# Altium schematic sheet PWR_SWITCH_CON_V1.0.SchDoc
size A4
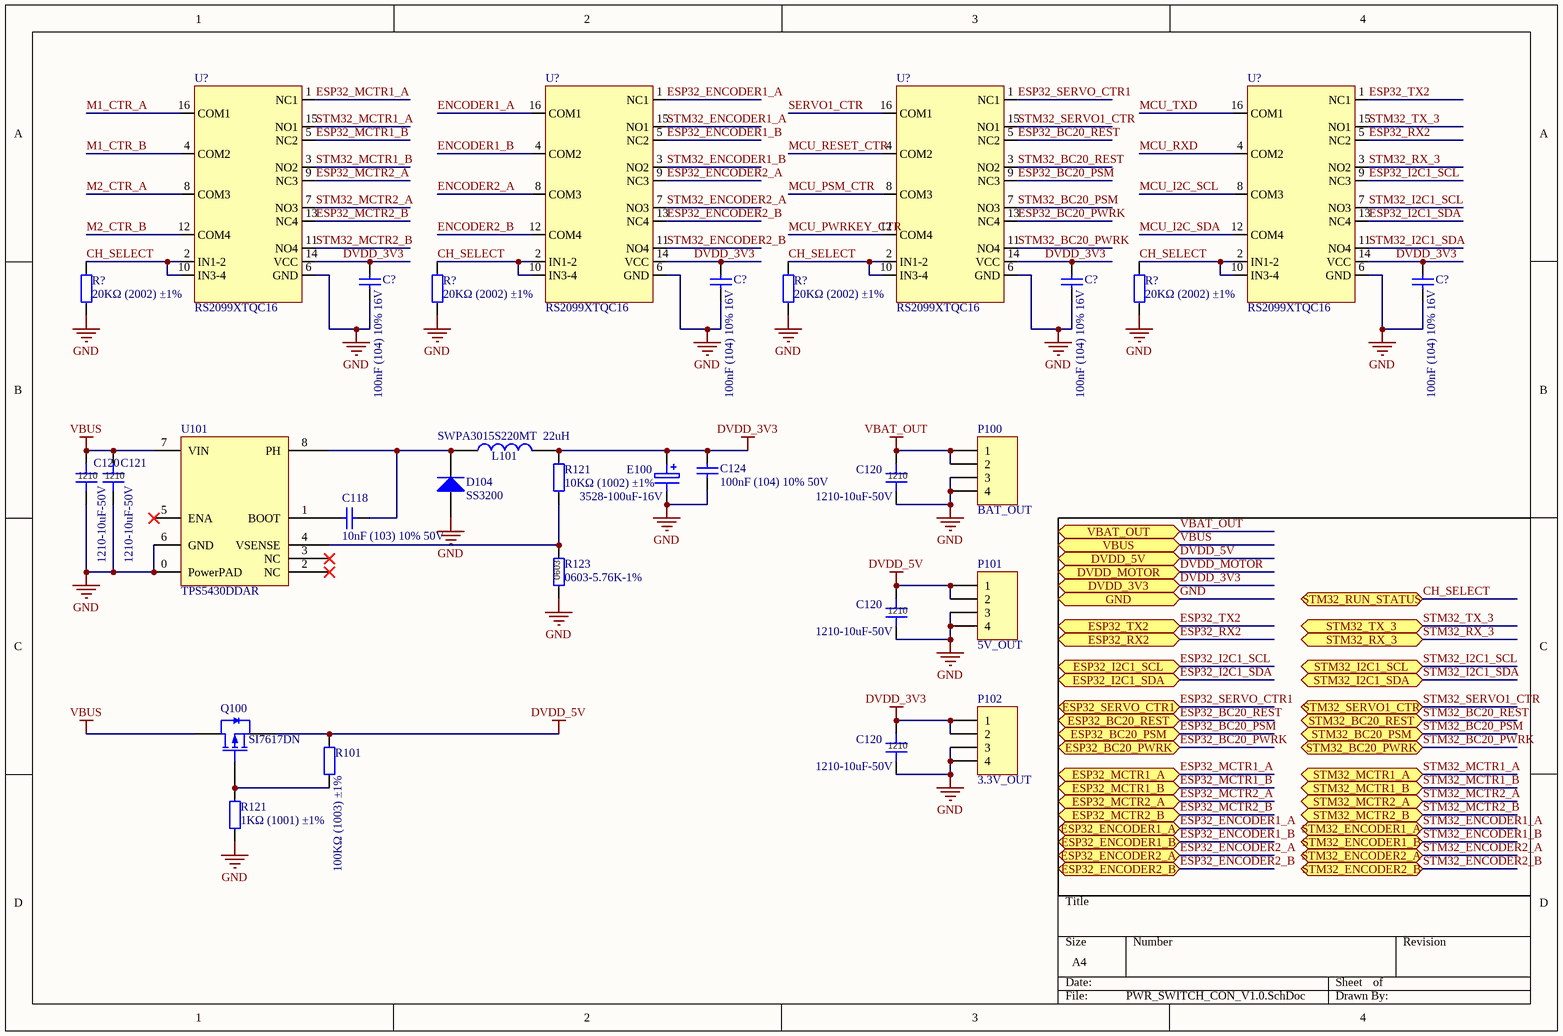
[diagram p0: PWR_SWITCH_CON_V1.0.SchDoc]

## Parts
(Parts that share a designator on the sheet are numbered #1, #2 ... from top to bottom, then left to right.)
C118  10nF (103) 10% 50V  [0603_C]
C120#1  1210-10uF-50V  [1210_C]
C120#2  1210-10uF-50V  [1210_C]
C120#3  1210-10uF-50V  [1210_C]
C120#4  1210-10uF-50V  [1210_C]
C121  1210-10uF-50V  [1210_C]
C124  100nF (104) 10% 50V  [0603_C]
C?#1  100nF (104) 10% 16V  [0402_C]
C?#2  100nF (104) 10% 16V  [0402_C]
C?#3  100nF (104) 10% 16V  [0402_C]
C?#4  100nF (104) 10% 16V  [0402_C]
D104  SS3200  [SMA(DO-214AC)_S1]
E100  3528-100uF-16V  [ES_3528]
L101  SWPA3015S220MT  22uH  [L 3.0*3.0*1.5]
P100  BAT_OUT  [HDR1X4]
P101  5V_OUT  [HDR1X4]
P102  3.3V_OUT  [HDR1X4]
Q100  SI7617DN  [PAK-1212-8]
R101  100KΩ (1003) ±1%  [0603_R]
R121#1  10KΩ (1002) ±1%  [0603_R]
R121#2  1KΩ (1001) ±1%  [0603_R]
R123  0603-5.76K-1%  [0603_R]
R?#1  20KΩ (2002) ±1%  [0402_R]
R?#2  20KΩ (2002) ±1%  [0402_R]
R?#3  20KΩ (2002) ±1%  [0402_R]
R?#4  20KΩ (2002) ±1%  [0402_R]
U101  TPS5430DDAR  [SOP-8_150mil DCDC]
U?#1  RS2099XTQC16  [QFN-16_3x3x05P]
U?#2  RS2099XTQC16  [QFN-16_3x3x05P]
U?#3  RS2099XTQC16  [QFN-16_3x3x05P]
U?#4  RS2099XTQC16  [QFN-16_3x3x05P]

## Ports
DVDD_3V3, DVDD_5V, DVDD_MOTOR, ESP32_BC20_PSM, ESP32_BC20_PWRK, ESP32_BC20_REST, ESP32_ENCODER1_A, ESP32_ENCODER1_B, ESP32_ENCODER2_A, ESP32_ENCODER2_B, ESP32_I2C1_SCL, ESP32_I2C1_SDA, ESP32_MCTR1_A, ESP32_MCTR1_B, ESP32_MCTR2_A, ESP32_MCTR2_B, ESP32_RX2, ESP32_SERVO_CTR1, ESP32_TX2, GND, STM32_BC20_PSM, STM32_BC20_PWRK, STM32_BC20_REST, STM32_ENCODER1_A, STM32_ENCODER1_B, STM32_ENCODER2_A, STM32_ENCODER2_B, STM32_I2C1_SCL, STM32_I2C1_SDA, STM32_MCTR1_A, STM32_MCTR1_B, STM32_MCTR2_A, STM32_MCTR2_B, STM32_RUN_STATUS, STM32_RX_3, STM32_SERVO1_CTR, STM32_TX_3, VBAT_OUT, VBUS

## Nets
DVDD_3V3: C120#4.1 C124.2 C?#1.2 C?#2.2 C?#3.2 C?#4.2 E100.1 L101.2 P102.1 P102.2 R121#1.2 U?#1.14(VCC) U?#2.14(VCC) U?#3.14(VCC) U?#4.14(VCC) ; port DVDD_3V3
DVDD_5V: C120#3.1 P101.1 P101.2 Q100.2(S) R101.2 ; port DVDD_5V
GND: C120#1.2 C120#2.2 C120#3.2 C120#4.2 C121.2 C124.1 C?#1.1 C?#2.1 C?#3.1 C?#4.1 D104.1(A) E100.2(E) P100.3 P100.4 P101.3 P101.4 P102.3 P102.4 R121#2.1 R123.1 R?#1.1 R?#2.1 R?#3.1 R?#4.1 U101.0(PowerPAD) U101.6(GND) U?#1.6(GND) U?#2.6(GND) U?#3.6(GND) U?#4.6(GND) ; port GND
VBAT_OUT: C120#2.1 P100.1 P100.2 ; port VBAT_OUT
VBUS: C120#1.1 C121.1 Q100.3(D) U101.7(VIN) ; port VBUS
CH_SELECT: R?#1.2 R?#2.2 R?#3.2 R?#4.2 U?#1.2(IN1-2) U?#1.10(IN3-4) U?#2.2(IN1-2) U?#2.10(IN3-4) U?#3.2(IN1-2) U?#3.10(IN3-4) U?#4.2(IN1-2) U?#4.10(IN3-4) ; port STM32_RUN_STATUS
DVDD_MOTOR: port DVDD_MOTOR
ENCODER1_A: U?#2.16(COM1)
ENCODER1_B: U?#2.4(COM2)
ENCODER2_A: U?#2.8(COM3)
ENCODER2_B: U?#2.12(COM4)
ESP32_BC20_PSM: U?#3.9(NC3) ; port ESP32_BC20_PSM
ESP32_BC20_PWRK: U?#3.13(NC4) ; port ESP32_BC20_PWRK
ESP32_BC20_REST: U?#3.5(NC2) ; port ESP32_BC20_REST
ESP32_ENCODER1_A: U?#2.1(NC1) ; port ESP32_ENCODER1_A
ESP32_ENCODER1_B: U?#2.5(NC2) ; port ESP32_ENCODER1_B
ESP32_ENCODER2_A: U?#2.9(NC3) ; port ESP32_ENCODER2_A
ESP32_ENCODER2_B: U?#2.13(NC4) ; port ESP32_ENCODER2_B
ESP32_I2C1_SCL: U?#4.9(NC3) ; port ESP32_I2C1_SCL
ESP32_I2C1_SDA: U?#4.13(NC4) ; port ESP32_I2C1_SDA
ESP32_MCTR1_A: U?#1.1(NC1) ; port ESP32_MCTR1_A
ESP32_MCTR1_B: U?#1.5(NC2) ; port ESP32_MCTR1_B
ESP32_MCTR2_A: U?#1.9(NC3) ; port ESP32_MCTR2_A
ESP32_MCTR2_B: U?#1.13(NC4) ; port ESP32_MCTR2_B
ESP32_RX2: U?#4.5(NC2) ; port ESP32_RX2
ESP32_SERVO_CTR1: U?#3.1(NC1) ; port ESP32_SERVO_CTR1
ESP32_TX2: U?#4.1(NC1) ; port ESP32_TX2
M1_CTR_A: U?#1.16(COM1)
M1_CTR_B: U?#1.4(COM2)
M2_CTR_A: U?#1.8(COM3)
M2_CTR_B: U?#1.12(COM4)
MCU_I2C_SCL: U?#4.8(COM3)
MCU_I2C_SDA: U?#4.12(COM4)
MCU_PSM_CTR: U?#3.8(COM3)
MCU_PWRKEY_CTR: U?#3.12(COM4)
MCU_RESET_CTR: U?#3.4(COM2)
MCU_RXD: U?#4.4(COM2)
MCU_TXD: U?#4.16(COM1)
SERVO1_CTR: U?#3.16(COM1)
STM32_BC20_PSM: U?#3.7(NO3) ; port STM32_BC20_PSM
STM32_BC20_PWRK: U?#3.11(NO4) ; port STM32_BC20_PWRK
STM32_BC20_REST: U?#3.3(NO2) ; port STM32_BC20_REST
STM32_ENCODER1_A: U?#2.15(NO1) ; port STM32_ENCODER1_A
STM32_ENCODER1_B: U?#2.3(NO2) ; port STM32_ENCODER1_B
STM32_ENCODER2_A: U?#2.7(NO3) ; port STM32_ENCODER2_A
STM32_ENCODER2_B: U?#2.11(NO4) ; port STM32_ENCODER2_B
STM32_I2C1_SCL: U?#4.7(NO3) ; port STM32_I2C1_SCL
STM32_I2C1_SDA: U?#4.11(NO4) ; port STM32_I2C1_SDA
STM32_MCTR1_A: U?#1.15(NO1) ; port STM32_MCTR1_A
STM32_MCTR1_B: U?#1.3(NO2) ; port STM32_MCTR1_B
STM32_MCTR2_A: U?#1.7(NO3) ; port STM32_MCTR2_A
STM32_MCTR2_B: U?#1.11(NO4) ; port STM32_MCTR2_B
STM32_RX_3: U?#4.3(NO2) ; port STM32_RX_3
STM32_SERVO1_CTR: U?#3.15(NO1) ; port STM32_SERVO1_CTR
STM32_TX_3: U?#4.15(NO1) ; port STM32_TX_3
NetC118_1: C118.1 U101.1(BOOT)
NetC118_2: C118.2 D104.2(K) L101.1 U101.8(PH)
NetQ100_1: Q100.1(G) R101.1 R121#2.2
NetR121#1_1: R121#1.1 R123.2 U101.4(VSENSE)

Not connected (* = marked no-connect by the designer): U101 2(NC)* 3(NC)* 5(ENA)*

## Notes on the sheet
- (in symbol 0603 10KΩ (103) 1%) 0603
- (in symbol 1210 10uF (106) 10% 50V) 1210

## Library data of the parts
C118 = 0603 10nF (103) 10% 50V: 贴片电容; ComponentLink1Description: 供应商链接; ComponentLink1URL: http://www.szlcsc.com/product/details_58143.html; Package: 0603; Supplier: LC; SuppliersPartNumber: C57112
C120#1-C120#4 C121 = 1210 10uF (106) 10% 50V: 贴片电容
C124 = 0603 100nF (104) 10% 50V: 贴片电容; ComponentLink1Description: 供应商链接; ComponentLink1URL: http://www.szlcsc.com/product/details_15331.html; Package: 0603; Supplier: LC; SuppliersPartNumber: C14663
C?#1-C?#4 = 0402 100nF (104) 10% 16V: 贴片电容; ComponentLink1Description: 供应商链接; ComponentLink1URL: http://www.szlcsc.com/product/details_1877.html; Package: 0402; Supplier: LC; SuppliersPartNumber: C1525
D104 = SMA(DO-214AC) M7: 二极管
E100 = ES-3528: 贴片钽电容
L101 = 10uH 20%: 贴片电感
P100-P102 = Header 4: Header, 4-Pin; LatestRevisionDate: 17-Jul-2002; LatestRevisionNote: Re-released for DXP Platform.; Publisher: Altium Limited
Q100 = SI7617DN: P-MOS
R101 = 0603 100KΩ (1003) 1%: 贴片电阻; ComponentLink1Description: 供应商链接; ComponentLink1URL: http://www.szlcsc.com/product/details_26546.html; Package: 0603; Supplier: LC; SuppliersPartNumber: C25803
R121#1 = 0603 10KΩ (1002) 1%: 贴片电阻; ComponentLink1Description: 供应商链接; ComponentLink1URL: http://www.szlcsc.com/product/details_26547.html; Package: 0603; Supplier: LC; SuppliersPartNumber: C25804
R121#2 = 0603 1KΩ (1001) 1%: 贴片电阻; ComponentLink1Description: 供应商链接; ComponentLink1URL: http://www.szlcsc.com/product/details_21904.html; Package: 0603; Supplier: LC; SuppliersPartNumber: C21190
R123 = 0603 10KΩ (103) 1%: 贴片电阻
R?#1-R?#4 = 0402 20KΩ (2002) 1%: 贴片电阻; ComponentLink1Description: 供应商链接; ComponentLink1URL: http://www.szlcsc.com/product/details_26508.html; Package: 0402; Supplier: LC; SuppliersPartNumber: C25765
U101 = TPS5430DDAR: DC-DC芯片; Notepad: 0 pin:        GND pin must be connected to the exposed pad for proper operation.; Package: SOP-8_EP_150mil
U?#1-U?#4 = RS2099XTQC16: IO SWITCH